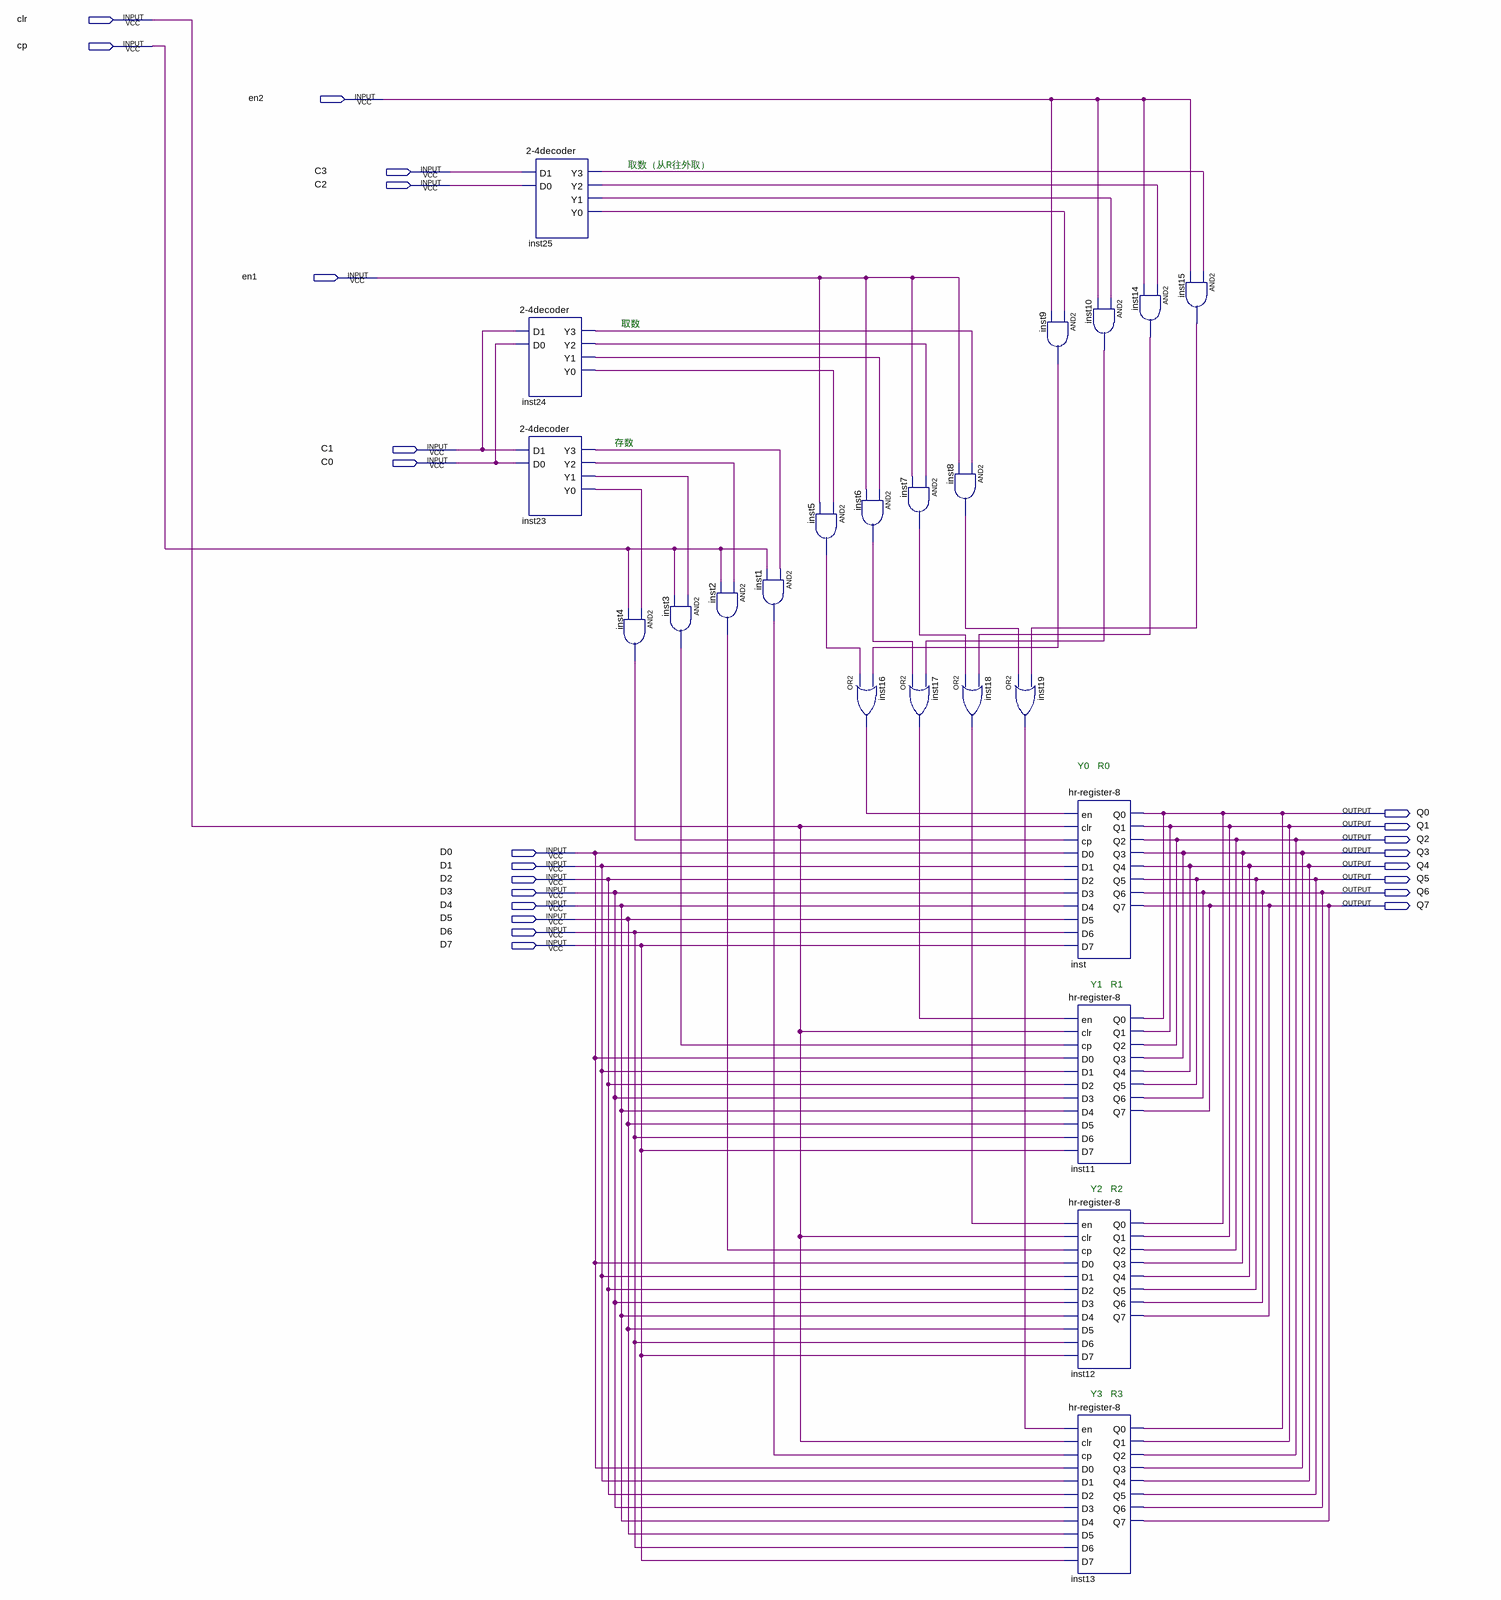
[diagram p0: schematic sheet]
// Quartus schematic general-register.bdf as structural Verilog: 23 symbols, 24 pins
module \general-register  (
  input  clr,
  input  cp,
  input  en2,
  input  C3,
  input  C2,
  input  en1,
  input  C1,
  input  C0,
  input  D0,
  input  D1,
  input  D2,
  input  D3,
  input  D4,
  input  D5,
  input  D6,
  input  D7,
  output Q0,
  output Q1,
  output Q2,
  output Q3,
  output Q4,
  output Q5,
  output Q6,
  output Q7
);

  wire inst1_out, inst2_out, inst3_out, inst4_out, inst5_out, inst6_out, inst7_out, inst8_out, inst9_out,
       inst10_out, inst14_out, inst15_out, inst16_out, inst17_out, inst18_out, inst19_out, inst23_y0,
       inst23_y1, inst23_y2, inst23_y3, inst24_y0, inst24_y1, inst24_y2, inst24_y3, inst25_y0, inst25_y1,
       inst25_y2, inst25_y3;

  \2-4decoder  inst25 (.D1(C3), .D0(C2), .Y3(inst25_y3), .Y2(inst25_y2), .Y1(inst25_y1), .Y0(inst25_y0));
  \2-4decoder  inst24 (.D1(C1), .D0(C0), .Y3(inst24_y3), .Y2(inst24_y2), .Y1(inst24_y1), .Y0(inst24_y0));
  \2-4decoder  inst23 (.D1(C1), .D0(C0), .Y3(inst23_y3), .Y2(inst23_y2), .Y1(inst23_y1), .Y0(inst23_y0));
  and inst4 (inst4_out, inst23_y0, cp);
  and inst3 (inst3_out, inst23_y1, cp);
  and inst2 (inst2_out, inst23_y2, cp);
  and inst1 (inst1_out, inst23_y3, cp);
  and inst5 (inst5_out, inst24_y0, en1);
  and inst6 (inst6_out, inst24_y1, en1);
  or inst16 (inst16_out, inst5_out, inst9_out);
  and inst8 (inst8_out, inst24_y3, en1);
  and inst7 (inst7_out, inst24_y2, en1);
  or inst17 (inst17_out, inst6_out, inst10_out);
  or inst18 (inst18_out, inst7_out, inst14_out);
  and inst9 (inst9_out, inst25_y0, en2);
  or inst19 (inst19_out, inst8_out, inst15_out);
  and inst10 (inst10_out, inst25_y1, en2);
  \hr-register-8  inst (
    .en(inst16_out), .clr(clr), .cp(inst4_out), .D0(D0), .D1(D1), .D2(D2), .D3(D3), .D4(D4), .D5(D5),
    .D6(D6), .D7(D7), .Q0(Q0), .Q1(Q1), .Q2(Q2), .Q3(Q3), .Q4(Q4), .Q5(Q5), .Q6(Q6), .Q7(Q7));
  \hr-register-8  inst11 (
    .en(inst17_out), .clr(clr), .cp(inst3_out), .D0(D0), .D1(D1), .D2(D2), .D3(D3), .D4(D4), .D5(D5),
    .D6(D6), .D7(D7), .Q0(Q0), .Q1(Q1), .Q2(Q2), .Q3(Q3), .Q4(Q4), .Q5(Q5), .Q6(Q6), .Q7(Q7));
  \hr-register-8  inst12 (
    .en(inst18_out), .clr(clr), .cp(inst2_out), .D0(D0), .D1(D1), .D2(D2), .D3(D3), .D4(D4), .D5(D5),
    .D6(D6), .D7(D7), .Q0(Q0), .Q1(Q1), .Q2(Q2), .Q3(Q3), .Q4(Q4), .Q5(Q5), .Q6(Q6), .Q7(Q7));
  \hr-register-8  inst13 (
    .en(inst19_out), .clr(clr), .cp(inst1_out), .D0(D0), .D1(D1), .D2(D2), .D3(D3), .D4(D4), .D5(D5),
    .D6(D6), .D7(D7), .Q0(Q0), .Q1(Q1), .Q2(Q2), .Q3(Q3), .Q4(Q4), .Q5(Q5), .Q6(Q6), .Q7(Q7));
  and inst14 (inst14_out, inst25_y2, en2);
  and inst15 (inst15_out, inst25_y3, en2);

  // Notes on the sheet:
  //   取数（从R往外取）
  //   取数
  //   存数
  //   Y0
  //   R0
  //   Y1
  //   R1
  //   Y2
  //   R2
  //   Y3
  //   R3
endmodule
